# EAGLE design buzzer (EAGLE 5.07)
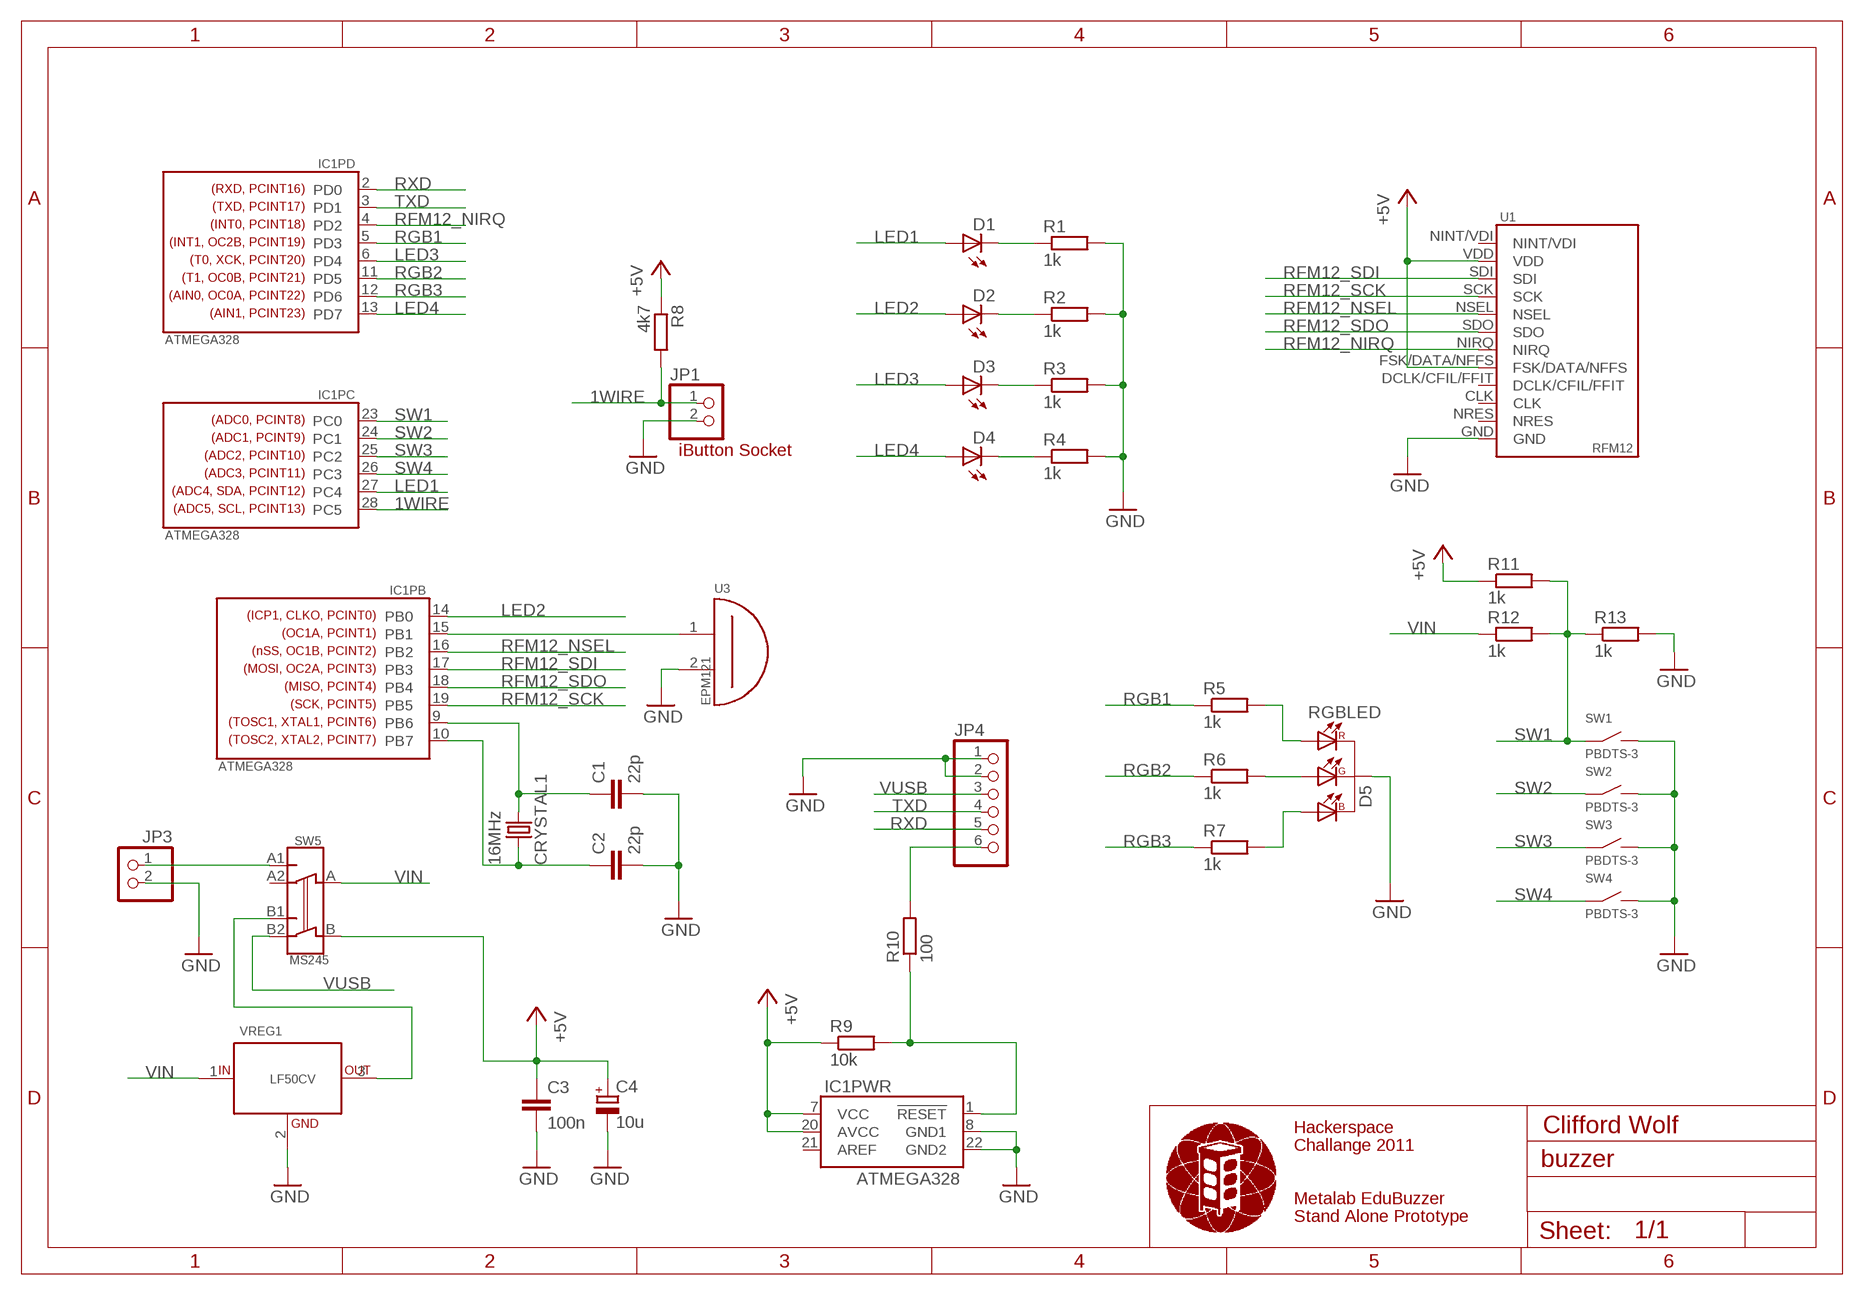
[diagram p0: schematic, sheet 1]

## Parts
C1  22p  C050-030X075  [C050-030X075]
C2  22p  C050-030X075  [C050-030X075]
C3  100n  C050-030X075  [C050-030X075]
C4  10u  CPOLE2-5L  [E2-5L]
CRYSTAL1  16MHz  CRYSTAL  [HC49US]
D1  LED5MM  [LED5MM]
D2  LED5MM  [LED5MM]
D3  LED5MM  [LED5MM]
D4  LED5MM  [LED5MM]
D5  RGBLED  [RGBLED]
IC1  ATMEGA328  ATMEGA168  [DIL28-3]
JP1  PINHD-1X2  [1X02]
JP3  PINHD-1X2  [1X02]
JP4  PINHD-1X6/90  [1X06/90]
R1  1k  R0309/10  [0309/10]
R2  1k  R0309/10  [0309/10]
R3  1k  R0309/10  [0309/10]
R4  1k  R0309/10  [0309/10]
R5  1k  R0309/10  [0309/10]
R6  1k  R0309/10  [0309/10]
R7  1k  R0309/10  [0309/10]
R8  4k7  R0309/10  [0309/10]
R9  10k  R0309/10  [0309/10]
R10  100  R0309/10  [0309/10]
R11  1k  R0309/10  [0309/10]
R12  1k  R0309/10  [0309/10]
R13  1k  R0309/10  [0309/10]
SW1  PBDTS-3  [DTS-3]
SW2  PBDTS-3  [DTS-3]
SW3  PBDTS-3  [DTS-3]
SW4  PBDTS-3  [DTS-3]
SW5  MS245  [MS245]
U1  RFM12  [RFM12]
U3  EPM121  [EPM121]
VREG1  LF50CV  [TO220]

## Nets
1WIRE: IC1.28(PC:PC5) JP1.1 R8.2
+5V [pwr]: C3.1 C4.+ IC1.7(PWR:VCC) IC1.20(PWR:AVCC) R8.1 R9.1 R11.1 SW5.B U1.FSK/DATA/NFFS U1.VDD
GND [pwr]: C1.2 C2.2 C3.2 C4.- D5.C IC1.8(PWR:GND1) IC1.22(PWR:GND2) JP1.2 JP3.2 JP4.1 JP4.2 R1.2 R2.2 R3.2 R4.2 R13.2 SW1.P$2 SW2.P$2 SW3.P$2 SW4.P$2 U1.GND U3.2 VREG1.2(GND)
LED1: D1.A IC1.27(PC:PC4)
LED2: D2.A IC1.14(PB:PB0)
LED3: D3.A IC1.6(PD:PD4)
LED4: D4.A IC1.13(PD:PD7)
N$1: D5.R R5.2
N$2: C1.1 CRYSTAL1.2 IC1.9(PB:PB6)
N$3: D1.K(C) R1.1
N$4: D5.G R6.2
N$5: D5.B R7.2
N$6: D2.K(C) R2.1
N$7: IC1.15(PB:PB1) U3.1
N$8: C2.1 CRYSTAL1.1 IC1.10(PB:PB7)
N$9 [pwr]: JP3.1 SW5.A1
N$10 [pwr]: SW5.B1 VREG1.3(OUT)
N$11: D3.K(C) R3.1
N$13: JP4.6 R10.2
N$14: D4.K(C) R4.1
N$15 [pwr]: IC1.1(PWR:RESET) R9.2 R10.1
RFM12_NIRQ: IC1.4(PD:PD2) U1.NIRQ
RFM12_NSEL: IC1.16(PB:PB2) U1.NSEL
RFM12_SCK: IC1.19(PB:PB5) U1.SCK
RFM12_SDI: IC1.17(PB:PB3) U1.SDI
RFM12_SDO: IC1.18(PB:PB4) U1.SDO
RGB1: IC1.5(PD:PD3) R5.1
RGB2: IC1.11(PD:PD5) R6.1
RGB3: IC1.12(PD:PD6) R7.1
RXD: IC1.2(PD:PD0) JP4.5
SW1: IC1.23(PC:PC0) R11.2 R12.2 R13.1 SW1.P$1
SW2: IC1.24(PC:PC1) SW2.P$1
SW3: IC1.25(PC:PC2) SW3.P$1
SW4: IC1.26(PC:PC3) SW4.P$1
TXD: IC1.3(PD:PD1) JP4.4
VIN [pwr]: R12.1 SW5.A VREG1.1(IN)
VUSB [pwr]: JP4.3 SW5.B2
Unconnected: IC1.21(PWR:AREF) SW5.A2 U1.CLK U1.DCLK/CFIL/FFIT U1.NINT/VDI U1.NRES

## Notes on the sheet
- iButton Socket
- Hackerspace | Clifford Wolf
- Challange 2011
- Metalab EduBuzzer
- Stand Alone Prototype

## Library data of the parts
C1-C3 = mp_passive:C: CAPACITOR, European symbol
C4 = mp_passive:CPOL: POLARIZED CAPACITOR, European symbol
CRYSTAL1 = mp_passive:CRYSTAL: Crystal
D1-D4 = mp_diode:LED: LED (5mm)
D5 = mp_diode:RGBLED: LUCKY LIGHT GB-399 Series (Common Cathode)
IC1 = mp_prog:ATMEGA168: ATMEGA168
JP1 JP3 = mpc_pinhead:PINHD-1X2: PIN HEADER
JP4 = mpc_pinhead:PINHD-1X6: PIN HEADER
R1-R13 = mp_passive:R: RESISTOR, European symbol
SW1-SW4 = mp_switch:PB: Push-Button
SW5 = mp_switch:MS245: MIYAMA MS 245
U1 = mp_modules:RFM12: RFM12 868 MHz Funk-Transceiver
U3 = mp_modules:EPM121: EPM121 Piezo
VREG1 = mp_vreg:LF50CV: LF50CV Low Drop 5.0V Voltage Regulator

## Net classes
1 pwr: width 0.381 mm

## Board
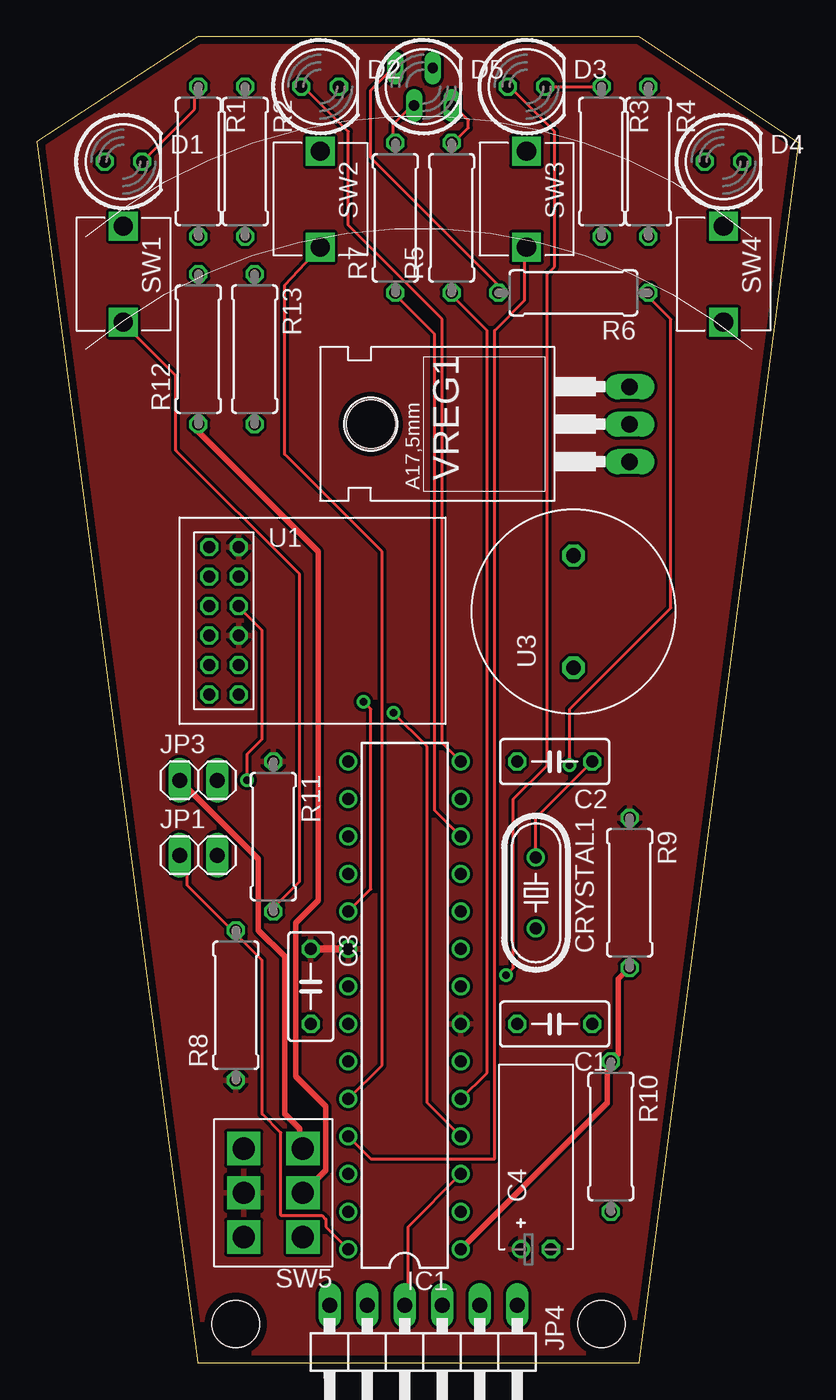
[diagram p1: board, top side]
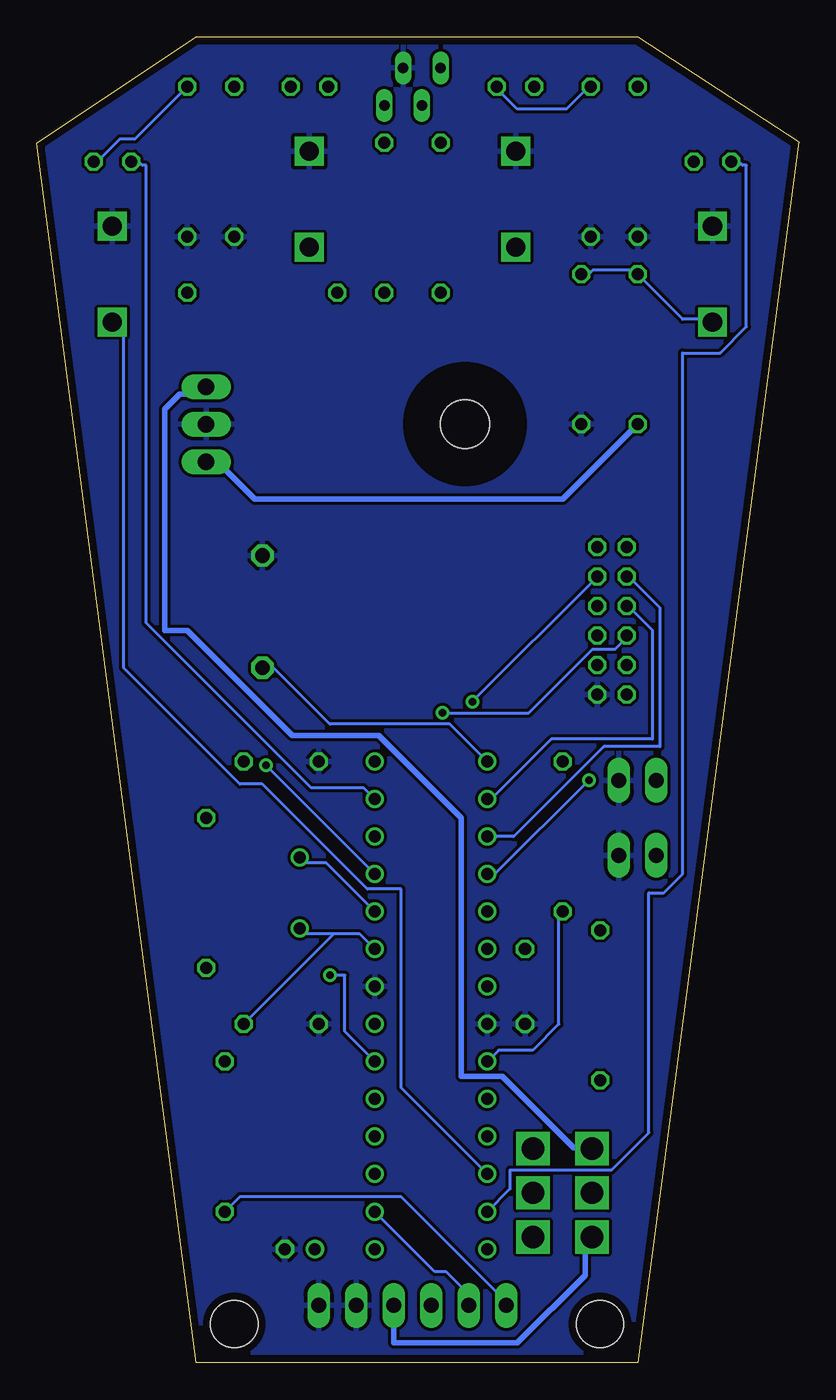
[diagram p2: board, bottom side, seen from below]

Size 51.6 x 89.8 mm. Coordinates in mm from the lower left corner, seen from the top.
Outline: 10.9,0 40.8,0 51.6,82.6 40.8,89.8 10.9,89.8 0,82.7 10.9,0
Copper layers (1*16): Top 0.035mm / dielectric 1.5mm / Bottom 0.035mm
Design rules "qprules_8mil": minimum track width 8mil, minimum drill 20mil, track to track 8mil, track to pad 8mil, pad to pad 8mil, via to via 8mil, smd to smd 8mil, copper to edge 20mil, drill to drill 20mil, minimum pad ring 8mil, minimum via ring 8mil, stop-mask expansion 0mil, vias tented up to drill 0mil, thermal gap 10mil
Holes 3.2 mm at 13.47,2.61 38.23,2.61

### Footprints (pad centres in the part's own frame; a part is rotated, then mirrored left to right if it is on the bottom)
C050-030X075 = drill 0.813 octagon: 1 -2.54,0; 2 2.54,0
E2-5L = drill 0.813 pad 1.27 round: + -1.016,0 | drill 0.813 pad 1.27 octagon: - 1.016,0
HC49US = drill 0.813 round: 1 -2.413,0; 2 2.413,0
LED5MM = drill 0.813 octagon: A -1.27,0; K 1.27,0
RGBLED = drill 0.7 long: B -0.635,-1.27; C 0.635,1.27; G -1.905,1.27; R 1.905,-1.27
DIL28-3 = drill 0.813 round: 1 -16.51,-3.81; 2 -13.97,-3.81; 3 -11.43,-3.81; 4 -8.89,-3.81; 5 -6.35,-3.81; 6 -3.81,-3.81; 7 -1.27,-3.81; 8 1.27,-3.81; 9 3.81,-3.81; 10 6.35,-3.81; 11 8.89,-3.81; 12 11.43,-3.81; 13 13.97,-3.81; 14 16.51,-3.81; 15 16.51,3.81; 16 13.97,3.81; 17 11.43,3.81; 18 8.89,3.81; 19 6.35,3.81; 20 3.81,3.81; 21 1.27,3.81; 22 -1.27,3.81; 23 -3.81,3.81; 24 -6.35,3.81; 25 -8.89,3.81; 26 -11.43,3.81; 27 -13.97,3.81; 28 -16.51,3.81
1X02 = drill 1.016 long: 1 -1.27,0; 2 1.27,0
1X06/90 = drill 1.016 long: 1 -6.35,-3.81; 2 -3.81,-3.81; 3 -1.27,-3.81; 4 1.27,-3.81; 5 3.81,-3.81; 6 6.35,-3.81
0309/10 = drill 0.813 octagon: 1 -5.08,0; 2 5.08,0
DTS-3 = drill 1.3 square: P$1 3.25,0; P$2 -3.25,0
MS245 = drill 1.5 square: A -2,0; A1 -2,-3; A2 -2,3; B 2,0; B1 2,-3; B2 2,3
RFM12 = drill 0.8 octagon: CLK 4,4; DCLK/CFIL/FFIT 2,4; FSK/DATA/NFFS 4,6; GND 4,2; NINT/VDI 2,12; NIRQ 2,6; NRES 2,2; NSEL 2,8; SCK 4,10; SDI 2,10; SDO 4,8; VDD 4,12
EPM121 = drill 1 octagon: 1 -3.8,0; 2 3.8,0
TO220 = drill 1.118 long: 1 -2.54,-6.35; 2 0,-6.35; 3 2.54,-6.35 | hole 3.302: 0,11.176

### Placement (x,y rotation side)
C1  35.06,22.93 180 top
C2  35.06,40.71 180 top
C3  18.55,25.47 270 top
C4  33.79,7.69 0 top
CRYSTAL1  33.79,31.82 270 top
D1  5.85,81.35 0 top
D2  19.18,86.43 0 top
D3  33.16,86.43 0 top
D4  46.49,81.35 0 top
D5  26.17,86.43 0 top
IC1  24.9,24.2 90 top
JP1  10.93,34.36 0 top
JP3  10.93,39.44 0 top
JP4  26.17,0.07 180 top
R1  10.93,81.35 270 top
R2  14.11,81.35 270 top
R3  38.23,81.35 270 top
R4  41.41,81.35 270 top
R5  28.07,77.54 90 top
R6  36.33,72.46 180 top
R7  24.27,77.54 90 top
R8  13.47,24.2 90 top
R9  40.14,31.82 270 top
R10  38.87,15.31 270 top
R11  16.01,35.63 270 top
R12  10.93,68.65 90 top
R13  14.74,68.65 270 top
SW1  5.85,73.73 270 top
SW2  19.18,78.81 270 top
SW3  33.16,78.81 270 top
SW4  46.49,73.73 270 top
SW5  16.01,11.5 180 top
U1  9.66,43.25 0 top
U3  36.33,50.87 90 top
VREG1  33.79,63.57 90 top

### Tracks (layer width: path | path; a pad name or v marks a point on that pad's centre or on a via)
1WIRE
  Top 0.203: IC1.28 19.57,9.21 19.57,9.72 19.31,9.98 16.52,9.98 16.52,15.56 15.25,16.83 15.25,27.25 13.47,29.03 | JP1.1 10.17,33.85 10.17,32.33 13.47,29.03 | 13.47,29.03 R8.2
+5V
  Top 0.508: C3.1 IC1.20
  pour Top: -0.5,90.24 -0.5,-1.2 52.84,-1.2 52.84,90.24
GND
  pour Bottom: -0.5,90.24 -0.5,-1.2 52.84,-1.2 52.84,90.24
LED1
  Bottom 0.203: IC1.27 19.57,11.75 19.57,13.02 12.71,13.02 10.17,15.56 10.17,31.82 9.15,31.82 7.88,33.09 7.88,68.4 5.34,68.4 3.56,70.17 3.56,81.1 3.82,81.1 4.07,81.35 D1.A
LED2
  Top 0.203: IC1.14 27.44,41.98 27.44,70.68 21.09,77.03 21.09,83.38 18.04,86.43 D2.A
LED3  (via drill 0.51)
  Top 0.203: v31.76,26.23 32.27,26.74 32.27,38.17 34.55,40.46 34.55,73.73 35.06,74.24 35.06,83.38 32.01,86.43 D3.A
  Bottom 0.203: IC1.6 30.74,22.42 30.74,26.23 v31.76,26.23
LED4
  Bottom 0.203: IC1.13 29.47,38.93 33.03,38.93 44.2,50.11 44.2,81.1 44.46,81.1 44.71,81.35 D4.A
N$1
  Top 0.203: D5.R 28.2,85.16 29.22,84.14 29.22,83.64 28.2,82.62 R5.2
N$2
  Bottom 0.203: IC1.9 29.73,29.03 31.5,29.03 | 31.5,29.03 33.54,29.03 33.79,29.28 CRYSTAL1.2 | 31.5,29.03 C1.1
N$3
  Top 0.203: D1.K 10.68,84.91 10.68,85.67 10.93,85.92 R1.1
N$4
  Top 0.203: R6.2 31.25,72.97 22.61,81.6 22.61,86.18 24.14,87.7 D5.G
N$5
  Top 0.203: D5.B 25.41,85.16 24.14,83.89 24.14,82.62 R7.2
N$6
  Bottom 0.203: R2.1 14.23,86.43 15.76,84.91 19.06,84.91 20.58,86.43 D2.K
N$7
  Bottom 0.203: IC1.15 23.63,43.25 31.76,43.25 35.57,47.06 U3.1
N$8
  Top 0.203: C2.1 33.79,36.9 CRYSTAL1.1
  Bottom 0.203: IC1.10 32.01,33.85 33.54,33.85 33.79,34.11 CRYSTAL1.1
N$9
  Top 0.381: JP3.1 14.99,34.11 14.99,29.28 16.77,27.5 16.77,16.83 17.79,15.82 17.79,14.55 SW5.A1
N$10
  Bottom 0.381: VREG1.3 40.65,65.6 41.92,65.6 42.93,64.59 42.93,49.6 41.41,49.6 34.3,42.49 28.46,42.49 22.87,36.9 22.87,19.37 20.07,19.37 15.25,14.55 14.23,14.55 SW5.B1
N$11
  Top 0.203: D3.K R3.1
N$13
  Bottom 0.203: R10.2 37.85,11.25 26.93,11.25 19.82,4.13 JP4.6
N$14
  Bottom 0.203: R4.1 44.97,82.87 45.98,82.87 47.51,81.35 D4.K
N$15
  Top 0.381: IC1.1 38.62,17.6 38.62,20.14 R10.1 39.38,20.9 39.38,25.98 R9.2
RFM12_NIRQ  (via drill 0.51)
  Top 0.203: v24.14,44.01 26.42,41.73 26.42,17.6 IC1.4
  Bottom 0.203: v24.14,44.01 18.3,44.01 13.98,48.33 12.45,48.33 11.69,49.09 U1.NIRQ
RFM12_NSEL
  Bottom 0.203: IC1.16 20.84,38.17 16.77,42.23 9.91,42.23 9.91,49.6 11.44,51.12 U1.NSEL
RFM12_SCK  (via drill 0.51)
  Top 0.203: v22.11,44.77 22.61,44.27 22.61,32.07 IC1.19
  Bottom 0.203: v22.11,44.77 13.72,53.16 U1.SCK
RFM12_SDI
  Bottom 0.203: IC1.17 19.31,35.63 13.22,41.73 9.41,41.73 9.41,51.12 11.44,53.16 U1.SDI
RFM12_SDO  (via drill 0.51)
  Top 0.203: v14.23,39.44 14.23,41.22 15.25,42.23 15.25,49.6 13.72,51.12 U1.SDO
  Bottom 0.203: v14.23,39.44 20.58,33.09 IC1.18
RGB1
  Top 0.203: IC1.5 30.49,19.63 30.49,69.92 28.2,72.21 28.2,72.46 R5.1
RGB2  (via drill 0.51)
  Top 0.203: v36.08,40.46 36.08,44.27 42.93,51.12 42.93,70.68 41.41,72.21 R6.1
  Bottom 0.203: IC1.11 v36.08,40.46
RGB3
  Top 0.203: IC1.12 26.93,37.41 26.93,69.67 24.39,72.21 24.39,72.46 R7.1
RXD
  Bottom 0.203: IC1.2 24.65,6.17 23.88,6.17 22.36,4.64 JP4.5
SW1
  Top 0.203: R11.2 16.01,30.8 17.79,32.58 17.79,53.41 9.41,61.79 9.41,66.87 5.85,70.43 SW1.P$1
  Bottom 0.203: R13.1 14.23,73.73 13.98,73.98 11.18,73.98 R12.2 7.88,70.68 5.85,70.68 SW1.P$1 | IC1.23 20.33,21.15 18.04,21.15 16.26,22.93 16.26,30.55 R11.2
SW2
  Top 0.203: IC1.24 23.38,20.14 23.38,54.93 16.77,61.54 16.77,72.97 SW2.P$1
SW3
  Top 0.203: IC1.25 22.61,13.79 31,13.79 31,69.92 33.03,71.95 33.03,75.51 SW3.P$1
SW4
  Bottom 0.203: IC1.26 26.93,18.61 26.93,32.07 29.22,32.07 36.33,39.19 37.85,39.19 45.73,47.06 45.73,70.43 46.49,70.43 SW4.P$1
TXD
  Top 0.203: IC1.3 25.15,9.21 25.15,4.13 JP4.4
VIN
  Top 0.381: R12.1 10.93,63.06 19.06,54.93 19.06,31.31 17.53,29.79 17.53,19.37 19.57,17.34 19.57,13.02 18.04,11.5 SW5.A
  Bottom 0.381: R12.1 16.01,58.49 36.84,58.49 39.38,61.03 VREG1.1
VUSB
  Bottom 0.381: JP4.3 27.44,1.34 19.06,1.34 14.49,5.91 14.49,8.45 14.23,8.45 SW5.B2